# Altium project Inverter_540VDC.PrjPcb
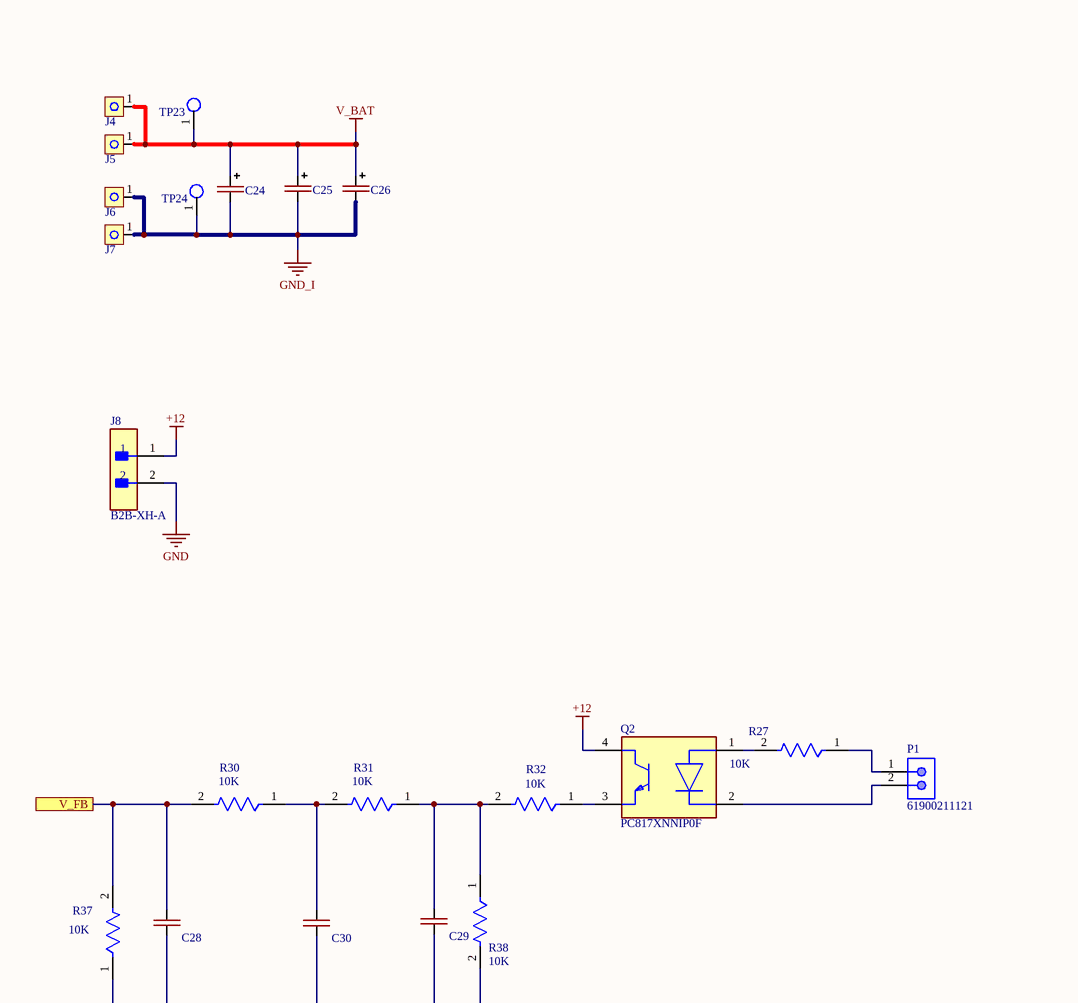
[diagram p0: Inverter_540VDC.SchDoc, top left]
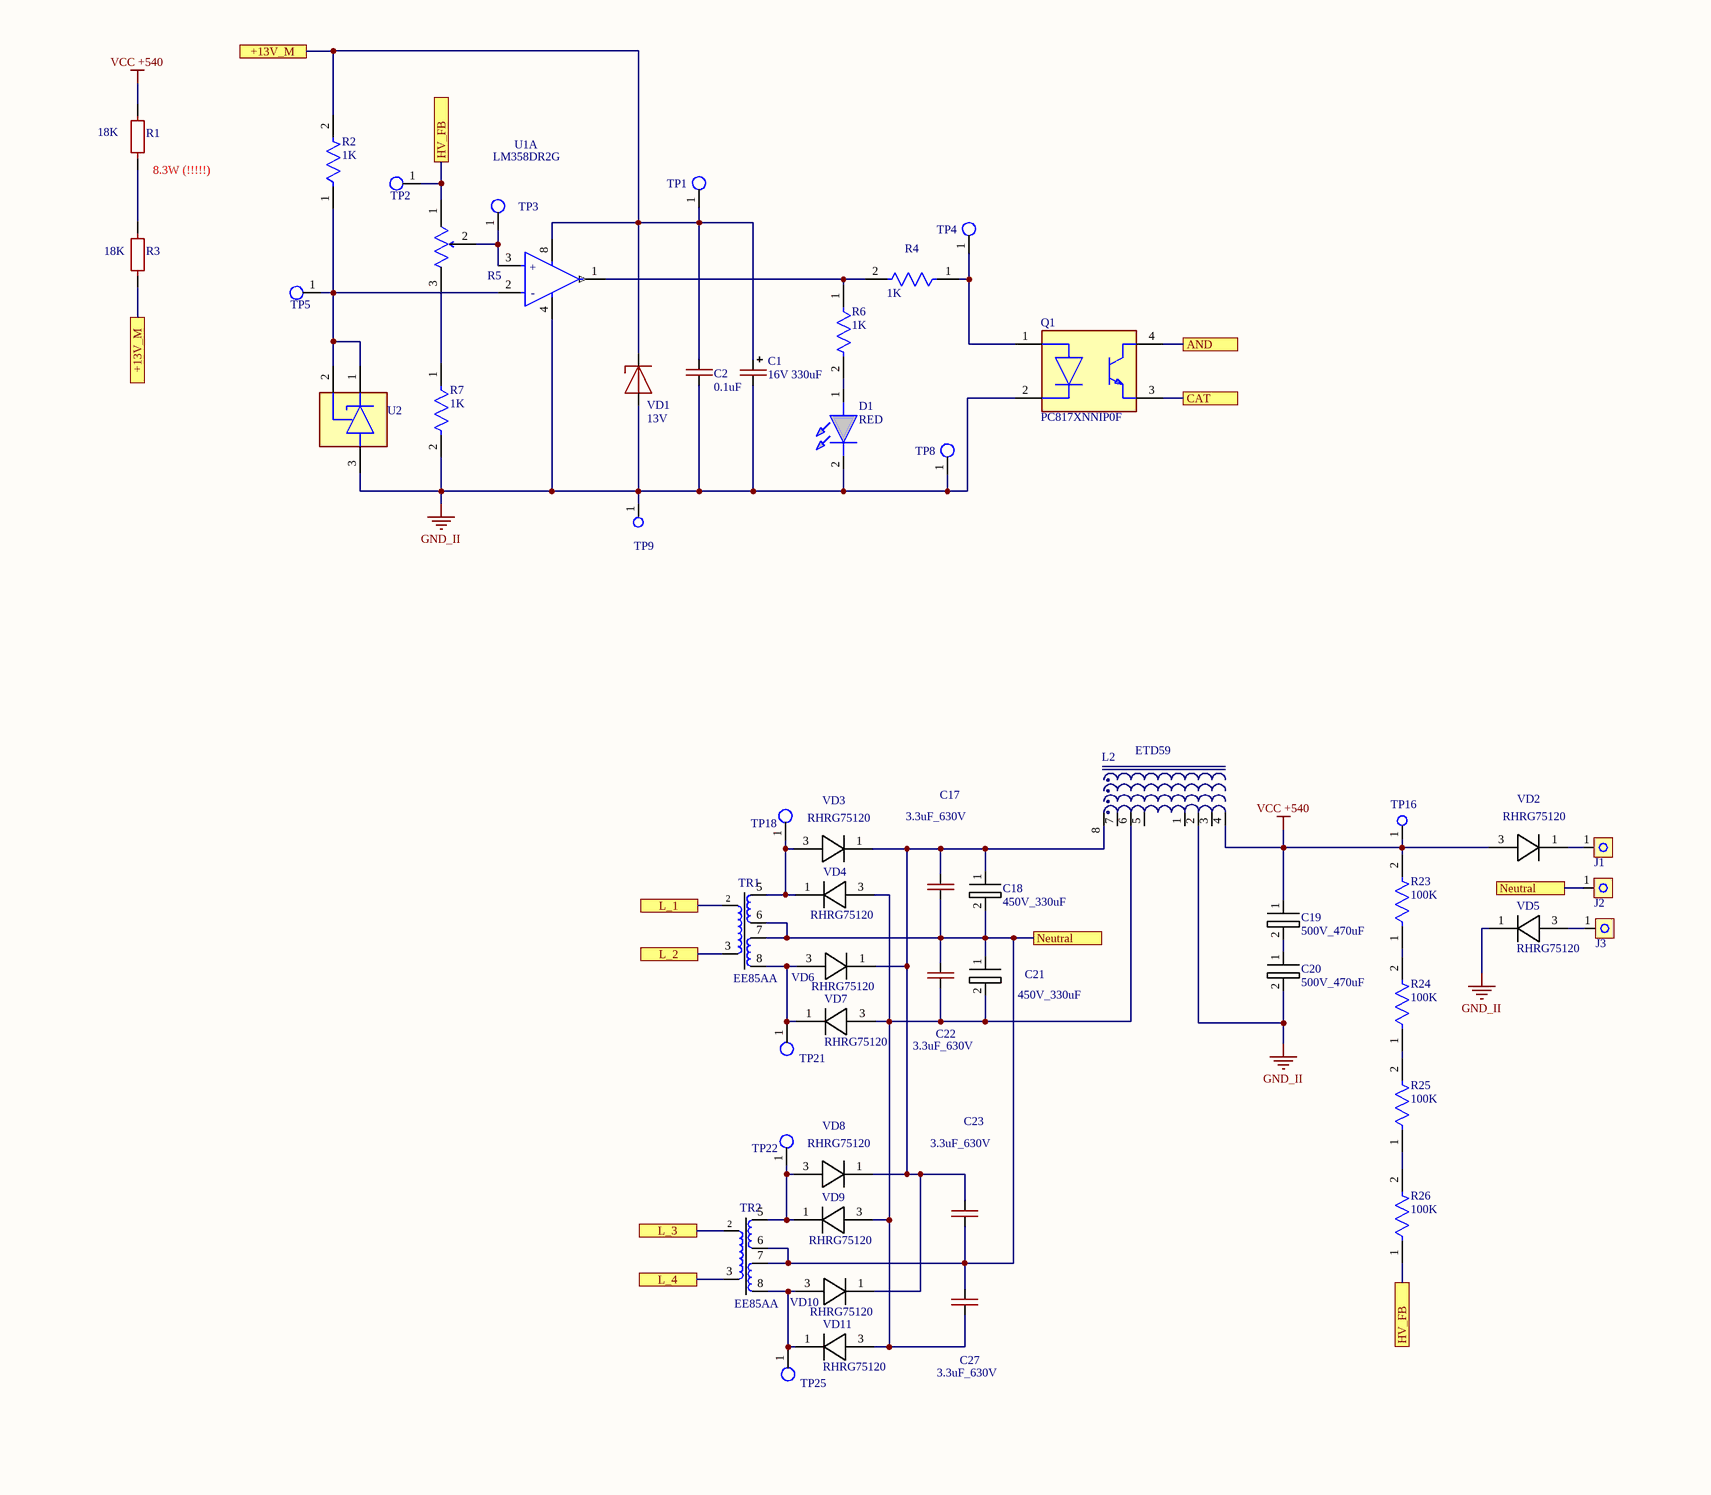
[diagram p1: Inverter_540VDC.SchDoc, top right]
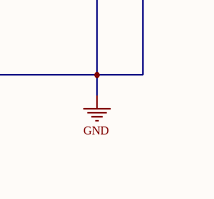
[diagram p2: Inverter_540VDC.SchDoc, bottom left]
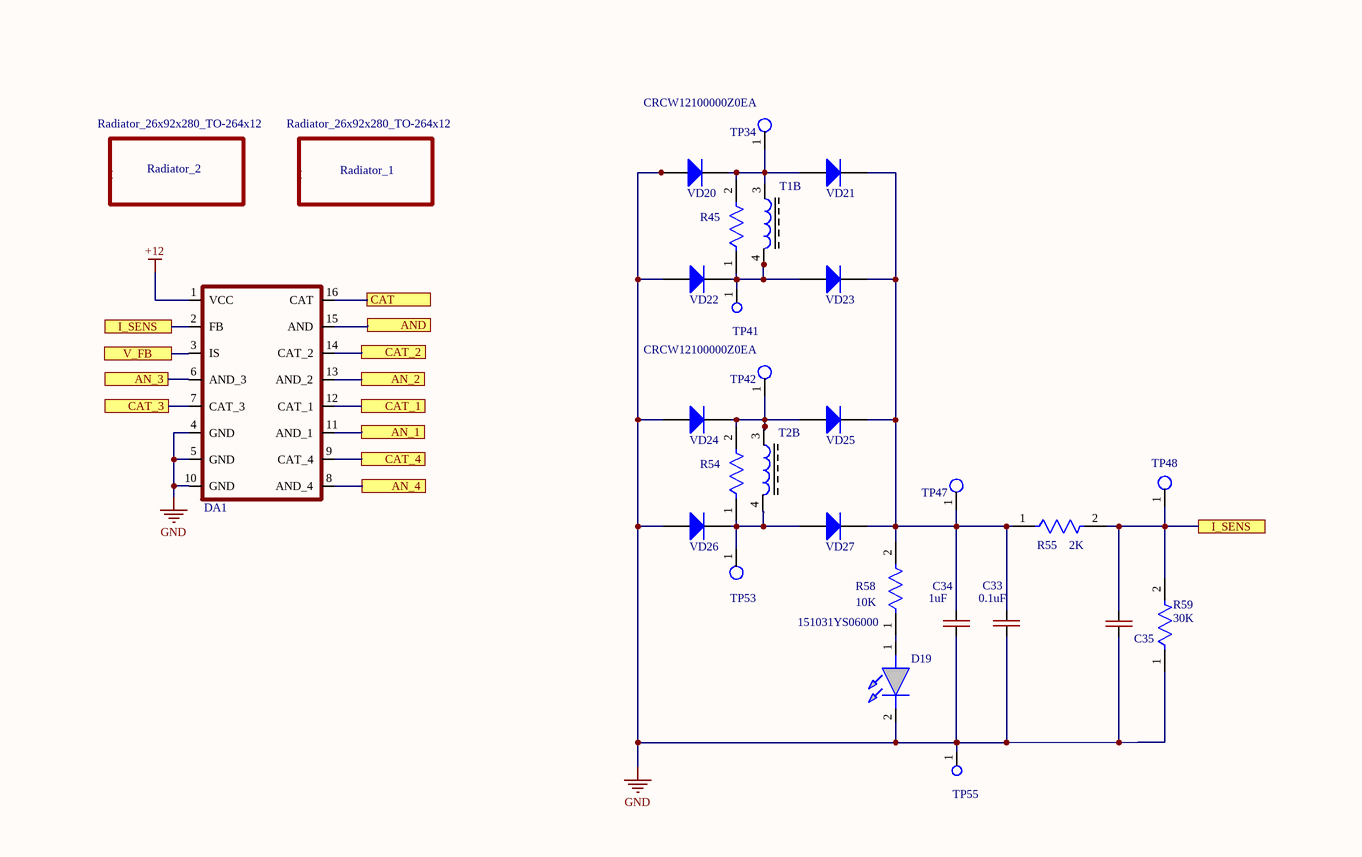
[diagram p3: Inverter_540VDC.SchDoc, bottom middle]
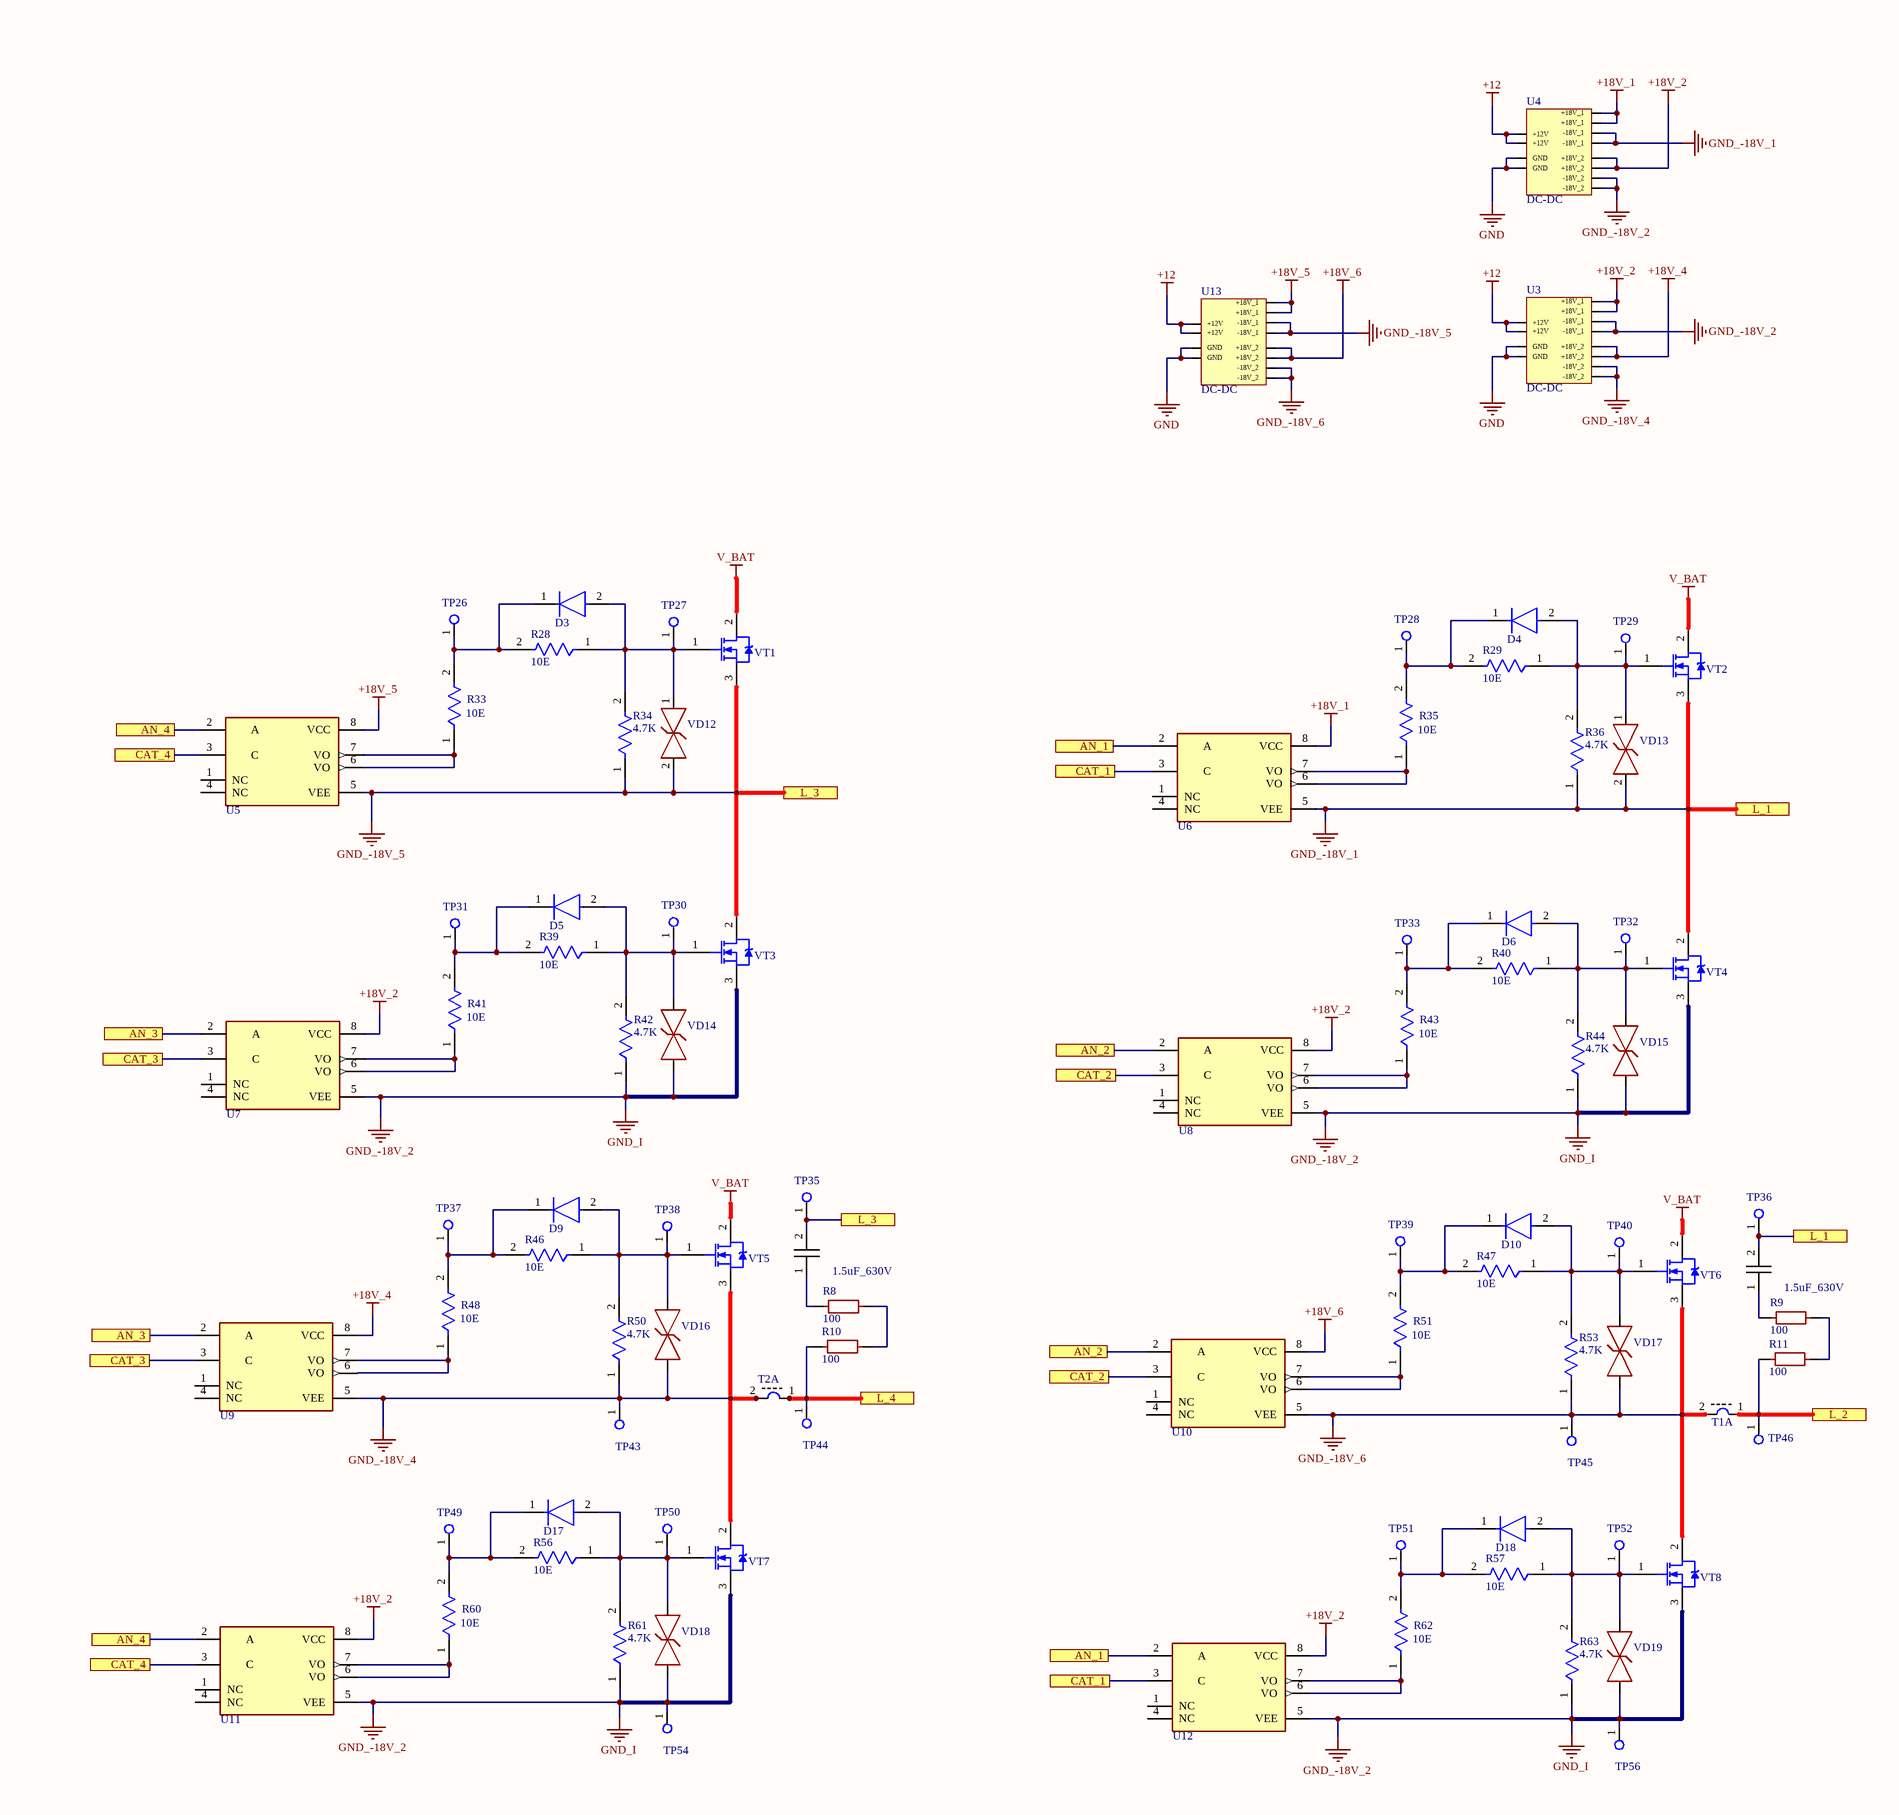
[diagram p4: Inverter_540VDC.SchDoc, bottom right]
1 sheet, 193 parts. Net scope: flat (ports and power ports of the same name join across sheets).
Board file: Inverter_540VDC.PcbDoc

## Sheet Inverter_540VDC.SchDoc
size 1200 x 800 mm; SheetNumber: 1; SheetTotal: 1; SPICEModelCacheFSXMRDBX: <root> / <DocumentId>FSXMRDBX</DocumentId> / </root>

### Parts
(Parts that share a designator on the sheet are numbered #1, #2 ... from top to bottom, then left to right.)
?#1  1.5uF_630V  [CAP_1.5uf_400V]
?#2  1.5uF_630V  [CAP_1.5uf_400V]
C1  16V 330uF  [CAP_SMD_Size_E]
C2  0.1uF  [CAP-0805]
C17  3.3uF_630V  [CAP_4.7uF_630V]
C18  450V_330uF  [CAP_450V_330uF]
C19  500V_470uF  [CAP_450V_330uF]
C20  500V_470uF  [CAP_450V_330uF]
C21  450V_330uF  [CAP_450V_330uF]
C22  3.3uF_630V  [CAP_4.7uF_630V]
C23  3.3uF_630V  [CAP_4.7uF_630V]
C24  1000uF_50V  [CAP_100V_1500uF]  (value not drawn)
C25  1000uF_50V  [CAP_100V_1500uF]  (value not drawn)
C26  1000uF_50V  [CAP_100V_1500uF]  (value not drawn)
C27  3.3uF_630V  [CAP_4.7uF_630V]
C28  CAP-NON-POLAR  [CAP-0805]  (value not drawn)
C29  CAP-NON-POLAR  [CAP-0805]  (value not drawn)
C30  CAP-NON-POLAR  [CAP-0805]  (value not drawn)
C33  0.1uF  [CAP-0805]
C34  1uF  [CAP-0805]
C35  CAP-NON-POLAR  [CAP-0805]  (value not drawn)
D1  RED  [LED_RED]
D3  US1G  [DO-214AA]  (value not drawn)
D4  US1G  [DO-214AA]  (value not drawn)
D5  US1G  [DO-214AA]  (value not drawn)
D6  US1G  [DO-214AA]  (value not drawn)
D9  US1G  [DO-214AA]  (value not drawn)
D10  US1G  [DO-214AA]  (value not drawn)
D17  US1G  [DO-214AA]  (value not drawn)
D18  US1G  [DO-214AA]  (value not drawn)
D19  151031YS06000  [LED_GREEN]
DA1  PWM_Controller_Half_Bridge_ONLY_TL494  [PWM_Controller_Half_Bridge_ONLY_TL494]  (value not drawn)
J1  MG_136_HT  [Conn_MEIGAN_MG136HT]  (value not drawn)
J2  MG_136_HT  [Conn_MEIGAN_MG136HT]  (value not drawn)
J3  MG_136_HT  [Conn_MEIGAN_MG136HT]  (value not drawn)
J4  MG_136_HT  [Conn_MEIGAN_MG136HT]  (value not drawn)
J5  MG_136_HT  [Conn_MEIGAN_MG136HT]  (value not drawn)
J6  MG_136_HT  [Conn_MEIGAN_MG136HT]  (value not drawn)
J7  MG_136_HT  [Conn_MEIGAN_MG136HT]  (value not drawn)
J8  B2B-XH-A  [B2B-XH-A]
L2  ETD59  [Drossel]
P1  61900211121  [61900211121]
Q1  PC817XNNIP0F  [FP-PC817XNNIP0F-MFG]
Q2  PC817XNNIP0F  [FP-PC817XNNIP0F-MFG]
R1  18K  [RES_5W_VERT]
R2  1K  [RES-0805]
R3  18K  [RES_5W_VERT]
R4  1K  [RES-0805]
R5  10K  [RES_Adj_3296W_Bourns]  (value not drawn)
R6  1K  [RES-0805]
R7  1K  [RES-0805]
R8  100  [RES_5W_VERT]
R9  100  [RES_5W_VERT]
R10  100  [RES_5W_VERT]
R11  100  [RES_5W_VERT]
R23  100K  [RES-0805]
R24  100K  [RES-0805]
R25  100K  [RES-0805]
R26  100K  [RES-0805]
R27  10K  [RES-0805]
R28  10E  [RES_SMD_1210_IPC_A]
R29  10E  [RES_SMD_1210_IPC_A]
R30  10K  [RES-0805]
R31  10K  [RES-0805]
R32  10K  [RES-0805]
R33  10E  [RES_SMD_1210_IPC_A]
R34  4.7K  [RES-0805]
R35  10E  [RES_SMD_1210_IPC_A]
R36  4.7K  [RES-0805]
R37  10K  [RES-0805]
R38  10K  [RES-0805]
R39  10E  [RES_SMD_1210_IPC_A]
R40  10E  [RES_SMD_1210_IPC_A]
R41  10E  [RES_SMD_1210_IPC_A]
R42  4.7K  [RES-0805]
R43  10E  [RES_SMD_1210_IPC_A]
R44  4.7K  [RES-0805]
R45  CRCW12100000Z0EA  [FP-CRCW1210-e3-IPC_B]
R46  10E  [RES_SMD_1210_IPC_A]
R47  10E  [RES_SMD_1210_IPC_A]
R48  10E  [RES_SMD_1210_IPC_A]
R50  4.7K  [RES-0805]
R51  10E  [RES_SMD_1210_IPC_A]
R53  4.7K  [RES-0805]
R54  CRCW12100000Z0EA  [FP-CRCW1210-e3-IPC_B]
R55  2K  [RES-0805]
R56  10E  [RES_SMD_1210_IPC_A]
R57  10E  [RES_SMD_1210_IPC_A]
R58  10K  [RES-0805]
R59  30K  [RES-0805]
R60  10E  [RES_SMD_1210_IPC_A]
R61  4.7K  [RES-0805]
R62  10E  [RES_SMD_1210_IPC_A]
R63  4.7K  [RES-0805]
Radiator_1  Radiator_26х92х280_ТО-264х12  [Radiator_26х92х280_ТО-264х12]  (value not drawn)
Radiator_2  Radiator_26х92х280_ТО-264х12  [Radiator_26х92х280_ТО-264х12]  (value not drawn)
T1  Current_SENS_VERT  [Current_SENS_VERT]  (value not drawn)  (parts A,B of 2)
T2  Current_SENS_VERT  [Current_SENS_VERT]  (value not drawn)  (parts A,B of 2)
TP1  Test_Point_PCB  [Test_Point]  (value not drawn)
TP2  Test_Point_PCB  [Test_Point]  (value not drawn)
TP3  Test_Point_PCB  [Test_Point]  (value not drawn)
TP4  Test_Point_PCB  [Test_Point]  (value not drawn)
TP5  Test_Point_PCB  [Test_Point]  (value not drawn)
TP8  Test_Point_PCB  [Test_Point]  (value not drawn)
TP9  Test_Point_PCB  [Pin_Test_Point(Pink)]  (value not drawn)
TP16  Test_Point_PCB  [Test_Point]  (value not drawn)
TP18  Test_Point_PCB  [Test_Point]  (value not drawn)
TP21  Test_Point_PCB  [Test_Point]  (value not drawn)
TP22  Test_Point_PCB  [Test_Point]  (value not drawn)
TP23  (no value)  [Test_Point]
TP24  Test_Point_PCB  [Test_Point]  (value not drawn)
TP25  Test_Point_PCB  [Test_Point]  (value not drawn)
TP26  Test_Point_PCB  [Test_Point]  (value not drawn)
TP27  Test_Point_PCB  [Test_Point]  (value not drawn)
TP28  Test_Point_PCB  [Test_Point]  (value not drawn)
TP29  Test_Point_PCB  [Test_Point]  (value not drawn)
TP30  Test_Point_PCB  [Test_Point]  (value not drawn)
TP31  Test_Point_PCB  [Test_Point]  (value not drawn)
TP32  Test_Point_PCB  [Test_Point]  (value not drawn)
TP33  Test_Point_PCB  [Test_Point]  (value not drawn)
TP34  Test_Point_PCB  [Test_Point]  (value not drawn)
TP35  Test_Point_PCB  [Test_Point]  (value not drawn)
TP36  Test_Point_PCB  [Test_Point]  (value not drawn)
TP37  Test_Point_PCB  [Test_Point]  (value not drawn)
TP38  Test_Point_PCB  [Test_Point]  (value not drawn)
TP39  Test_Point_PCB  [Test_Point]  (value not drawn)
TP40  Test_Point_PCB  [Test_Point]  (value not drawn)
TP41  Test_Point_PCB  [Test_Point]  (value not drawn)
TP42  Test_Point_PCB  [Test_Point]  (value not drawn)
TP43  Test_Point_PCB  [Pin_Test_Point(Orange)]  (value not drawn)
TP44  Test_Point_PCB  [Test_Point]  (value not drawn)
TP45  Test_Point_PCB  [Pin_Test_Point(Orange)]  (value not drawn)
TP46  Test_Point_PCB  [Test_Point]  (value not drawn)
TP47  Test_Point_PCB  [Test_Point]  (value not drawn)
TP48  (no value)  [Test_Point]
TP49  Test_Point_PCB  [Test_Point]  (value not drawn)
TP50  Test_Point_PCB  [Test_Point]  (value not drawn)
TP51  Test_Point_PCB  [Test_Point]  (value not drawn)
TP52  Test_Point_PCB  [Test_Point]  (value not drawn)
TP53  Test_Point_PCB  [Test_Point]  (value not drawn)
TP54  Test_Point_PCB  [Pin_Test_Point(Orange)]  (value not drawn)
TP55  Test_Point_PCB  [Pin_Test_Point(Orange)]  (value not drawn)
TP56  Test_Point_PCB  [Pin_Test_Point(Orange)]  (value not drawn)
TR1  EE85AA  [EE84AA Hor]
TR2  EE85AA  [EE84AA Hor]
U1  LM358DR2G  [FP-751-07-IPC_C]  (part A of 2)
U2  (no value)  [TL431_SOT-23-3(A)]
U3  DC-DC  [DC-DC_Bridge]
U4  DC-DC  [DC-DC_Bridge]
U5  HCPL-3120  [HCPL-3120]  (value not drawn)
U6  HCPL-3120  [HCPL-3120]  (value not drawn)
U7  HCPL-3120  [HCPL-3120]  (value not drawn)
U8  HCPL-3120  [HCPL-3120]  (value not drawn)
U9  HCPL-3120  [HCPL-3120]  (value not drawn)
U10  HCPL-3120  [HCPL-3120]  (value not drawn)
U11  HCPL-3120  [HCPL-3120]  (value not drawn)
U12  HCPL-3120  [HCPL-3120]  (value not drawn)
U13  DC-DC  [DC-DC_Bridge]
VD1  13V  [DO-017AA]
VD2  RHRG75120  [TO-247-2]
VD3  RHRG75120  [TO-247-2]
VD4  RHRG75120  [TO-247-2]
VD5  RHRG75120  [TO-247-2]
VD6  RHRG75120  [TO-247-2]
VD7  RHRG75120  [TO-247-2]
VD8  RHRG75120  [TO-247-2]
VD9  RHRG75120  [TO-247-2]
VD10  RHRG75120  [TO-247-2]
VD11  RHRG75120  [TO-247-2]
VD12  Suppressor  [DO-214AA]  (value not drawn)
VD13  Suppressor  [DO-214AA]  (value not drawn)
VD14  Suppressor  [DO-214AA]  (value not drawn)
VD15  Suppressor  [DO-214AA]  (value not drawn)
VD16  Suppressor  [DO-214AA]  (value not drawn)
VD17  Suppressor  [DO-214AA]  (value not drawn)
VD18  Suppressor  [DO-214AA]  (value not drawn)
VD19  Suppressor  [DO-214AA]  (value not drawn)
VD20  (no value)  [DIOD-SOD123-2_V]
VD21  (no value)  [DIOD-SOD123-2_V]
VD22  (no value)  [DIOD-SOD123-2_V]
VD23  (no value)  [DIOD-SOD123-2_V]
VD24  (no value)  [DIOD-SOD123-2_V]
VD25  (no value)  [DIOD-SOD123-2_V]
VD26  (no value)  [DIOD-SOD123-2_V]
VD27  (no value)  [DIOD-SOD123-2_V]
VT1  SPW47N60  [TO-247-3(Infineon)]  (value not drawn)
VT2  SPW47N60  [TO-247-3(Infineon)]  (value not drawn)
VT3  SPW47N60  [TO-247-3(Infineon)]  (value not drawn)
VT4  SPW47N60  [TO-247-3(Infineon)]  (value not drawn)
VT5  SPW47N60  [TO-247-3(Infineon)]  (value not drawn)
VT6  SPW47N60  [TO-247-3(Infineon)]  (value not drawn)
VT7  SPW47N60  [TO-247-3(Infineon)]  (value not drawn)
VT8  SPW47N60  [TO-247-3(Infineon)]  (value not drawn)

### Ports
+13V_M, AN_1, AN_2, AN_3, AN_4, AND, CAT, CAT_1, CAT_2, CAT_3, CAT_4, HV_FB, I_SENS, L_1, L_2, L_3, L_4, Neutral, V_FB

### Nets
+12: DA1.1(VCC) J8.1 Q2.4(C) U3.8(+12V) U3.9(+12V) U4.8(+12V) U4.9(+12V) U13.8(+12V) U13.9(+12V)
+18V_1: U4.1(+18V_1) U4.2(+18V_1) U6.8(VCC)
+18V_2: U3.1(+18V_1) U3.2(+18V_1) U4.17(+18V_2) U4.18(+18V_2) U7.8(VCC) U8.8(VCC) U11.8(VCC) U12.8(VCC)
+18V_4: U3.17(+18V_2) U3.18(+18V_2) U9.8(VCC)
+18V_5: U5.8(VCC) U13.1(+18V_1) U13.2(+18V_1)
+18V_6: U10.8(VCC) U13.17(+18V_2) U13.18(+18V_2)
GND: C28.1 C29.1 C30.1 C33.2 C34.2 C35.1 D19.2(K) DA1.4(GND) DA1.5(GND) DA1.10(GND) J8.2 R37.1 R38.2 R59.1 TP55.1(G9) U3.10(GND) U3.11(GND) U4.10(GND) U4.11(GND) U13.10(GND) U13.11(GND) VD20.2(A) VD22.2(A) VD24.2(A) VD26.2(A)
GND_-18V_1: ?#2.2 R36.1 TP36.1(G9) TR1.2 U4.3(-18V_1) U4.4(-18V_1) U6.5(VEE) VD13.2(A) VT2.3(SOURCE) VT4.2(DRAIN) ; port L_1
GND_-18V_2: C24.2(-) C25.2(-) C26.2(-) J6.1 J7.1 R42.1 R44.1 R61.1 R63.1 TP24.1(G9) TP54.1(G9) TP56.1(G9) U3.3(-18V_1) U3.4(-18V_1) U4.15(-18V_2) U4.16(-18V_2) U7.5(VEE) U8.5(VEE) U11.5(VEE) U12.5(VEE) VD14.1(C) VD15.1(C) VD18.1(C) VD19.1(C) VT3.3(SOURCE) VT4.3(SOURCE) VT7.3(SOURCE) VT8.3(SOURCE)  [also labelled GND_I]
GND_-18V_4: R50.1 T2.2 TP43.1(G9) U3.15(-18V_2) U3.16(-18V_2) U9.5(VEE) VD16.1(C) VT5.3(SOURCE) VT7.2(DRAIN)
GND_-18V_5: ?#1.2 R34.1 TP35.1(G9) TR2.2 U5.5(VEE) U13.3(-18V_1) U13.4(-18V_1) VD12.2(A) VT1.3(SOURCE) VT3.2(DRAIN) ; port L_3
GND_-18V_6: R53.1 T1.2 TP45.1(G9) U10.5(VEE) U13.15(-18V_2) U13.16(-18V_2) VD17.1(C) VT6.3(SOURCE) VT8.2(DRAIN)
GND_II: C1.2(-) C2.1 C20.2 D1.2(K) L2.2 Q1.2(C) R7.2 TP8.1(G9) TP9.1(G9) U1.4(VEE/GND) U2.3(A) VD1.2(A) VD5.1
V_BAT: C24.1(+) C25.1(+) C26.1(+) J4.1 J5.1 TP23.1(G9) VT1.2(DRAIN) VT2.2(DRAIN) VT5.2(DRAIN) VT6.2(DRAIN)
VCC +540: C19.1 L2.4 R1.2 R23.2 TP16.1(G9) VD2.3
Net?#1_1: ?#1.1 R8.2
Net?#2_1: ?#2.1 R9.2
NetC1_1: C1.1(+) C2.2 R2.2 R3.1 TP1.1(G9) U1.8(VCC) VD1.1(C) ; port +13V_M
NetC17_1: C17.1 C18.2 C21.1 C22.2 C23.1 C27.2 J2.1 TR1.6 TR1.7 TR2.6 TR2.7 ; port Neutral
NetC17_2: C17.2 C18.1 C23.2 L2.8 VD3.1 VD6.1 VD8.1 VD10.1
NetC19_2: C19.2 C20.1
NetC21_2: C21.2 C22.1 C27.1 L2.6 VD4.3 VD7.3 VD9.3 VD11.3
NetC28_2: C28.2 DA1.3(IS) R30.2 R37.2 ; port V_FB
NetC29_2: C29.2 R31.1 R32.2 R38.1
NetC30_2: C30.2 R30.1 R31.2
NetC33_1: C33.1 C34.1 R55.1 R58.2 TP47.1(G9) VD21.1(K) VD23.1(K) VD25.1(K) VD27.1(K)
NetC35_2: C35.2 DA1.2(FB) R55.2 R59.2 TP48.1(G9) ; port I_SENS
NetD1_1: D1.1(A) R6.2
NetD3_1: D3.1(C) R28.2 R33.2 TP26.1(G9)
NetD3_2: D3.2(A) R28.1 R34.2 TP27.1(G9) VD12.1(C) VT1.1(GATE)
NetD4_1: D4.1(C) R29.2 R35.2 TP28.1(G9)
NetD4_2: D4.2(A) R29.1 R36.2 TP29.1(G9) VD13.1(C) VT2.1(GATE)
NetD5_1: D5.1(C) R39.2 R41.2 TP31.1(G9)
NetD5_2: D5.2(A) R39.1 R42.2 TP30.1(G9) VD14.2(A) VT3.1(GATE)
NetD6_1: D6.1(C) R40.2 R43.2 TP33.1(G9)
NetD6_2: D6.2(A) R40.1 R44.2 TP32.1(G9) VD15.2(A) VT4.1(GATE)
NetD9_1: D9.1(C) R46.2 R48.2 TP37.1(G9)
NetD9_2: D9.2(A) R46.1 R50.2 TP38.1(G9) VD16.2(A) VT5.1(GATE)
NetD10_1: D10.1(C) R47.2 R51.2 TP39.1(G9)
NetD10_2: D10.2(A) R47.1 R53.2 TP40.1(G9) VD17.2(A) VT6.1(GATE)
NetD17_1: D17.1(C) R56.2 R60.2 TP49.1(G9)
NetD17_2: D17.2(A) R56.1 R61.2 TP50.1(G9) VD18.2(A) VT7.1(GATE)
NetD18_1: D18.1(C) R57.2 R62.2 TP51.1(G9)
NetD18_2: D18.2(A) R57.1 R63.2 TP52.1(G9) VD19.2(A) VT8.1(GATE)
NetD19_1: D19.1(A) R58.1
NetDA1_6: DA1.6(AND_3) U7.2(A) U9.2(A) ; port AN_3
NetDA1_7: DA1.7(CAT_3) U7.3(C) U9.3(C) ; port CAT_3
NetDA1_8: DA1.8(AND_4) U5.2(A) U11.2(A) ; port AN_4
NetDA1_9: DA1.9(CAT_4) U5.3(C) U11.3(C) ; port CAT_4
NetDA1_11: DA1.11(AND_1) U6.2(A) U12.2(A) ; port AN_1
NetDA1_12: DA1.12(CAT_1) U6.3(C) U12.3(C) ; port CAT_1
NetDA1_13: DA1.13(AND_2) U8.2(A) U10.2(A) ; port AN_2
NetDA1_14: DA1.14(CAT_2) U8.3(C) U10.3(C) ; port CAT_2
NetDA1_15: DA1.15(AND) Q1.4(C) ; port AND
NetDA1_16: DA1.16(CAT) Q1.3(E) ; port CAT
NetJ1_1: J1.1 VD2.1
NetJ3_1: J3.1 VD5.3
NetP1_1: P1.1 R27.1
NetP1_2: P1.2 Q2.2(C)
NetQ1_1: Q1.1(A) R4.1 TP4.1(G9)
NetQ2_1: Q2.1(A) R27.2
NetQ2_3: Q2.3(E) R32.1
NetR1_1: R1.1 R3.2
NetR2_1: R2.1 TP5.1(G9) U1.2(INPUT_A-) U2.1(C) U2.2(REF)
NetR4_2: R4.2 R6.1 U1.1(OUTPUT_A)
NetR5_1: R5.1(CCW) R26.1 TP2.1(G9) ; port HV_FB
NetR5_2: R5.2(WIPER) TP3.1(G9) U1.3(INPUT_A+)
NetR5_3: R5.3(CW) R7.1
NetR8_1: R8.1 R10.1
NetR9_1: R9.1 R11.1
NetR10_2: R10.2 T2.1 TP44.1(G9) TR2.3 ; port L_4
NetR11_2: R11.2 T1.1 TP46.1(G9) TR1.3 ; port L_2
NetR23_1: R23.1 R24.2
NetR24_1: R24.1 R25.2
NetR25_1: R25.1 R26.2
NetR33_1: R33.1 U5.6(VO) U5.7(VO)
NetR35_1: R35.1 U6.6(VO) U6.7(VO)
NetR41_1: R41.1 U7.6(VO) U7.7(VO)
NetR43_1: R43.1 U8.6(VO) U8.7(VO)
NetR45_1: R45.1 T1.4 TP41.1(G9) VD22.1(K) VD23.2(A)
NetR45_2: R45.2 T1.3 TP34.1(G9) VD20.1(K) VD21.2(A)
NetR48_1: R48.1 U9.6(VO) U9.7(VO)
NetR51_1: R51.1 U10.6(VO) U10.7(VO)
NetR54_1: R54.1 T2.4 TP53.1(G9) VD26.1(K) VD27.2(A)
NetR54_2: R54.2 T2.3 TP42.1(G9) VD24.1(K) VD25.2(A)
NetR60_1: R60.1 U11.6(VO) U11.7(VO)
NetR62_1: R62.1 U12.6(VO) U12.7(VO)
NetTP18_1: TP18.1(G9) TR1.5 VD3.3 VD4.1
NetTP21_1: TP21.1(G9) TR1.8 VD6.3 VD7.1
NetTP22_1: TP22.1(G9) TR2.5 VD8.3 VD9.1
NetTP25_1: TP25.1(G9) TR2.8 VD10.3 VD11.1

Not connected (* = marked no-connect by the designer): L2 1 3 5 7; U5 1(NC) 4(NC); U6 1(NC) 4(NC); U7 1(NC) 4(NC); U8 1(NC) 4(NC); U9 1(NC) 4(NC); U10 1(NC) 4(NC); U11 1(NC) 4(NC); U12 1(NC) 4(NC)

### Notes on the sheet
- (near R1) 8.3W (!!!!!)
- (in symbol CMP-1310-00291-2, part A) +; -

### Library data of the parts
?#1 ?#2 = 3.3uF_630V
C1 = CAP_POL_SMD
C2 C17 C22 C23 C27 C33 C34 = CAP-NON-POLAR
C18-C21 = CAP_450V_330uF
C24-C26 = CAP_polar_Hitano
D1 D19 = LED: WURTH ELEKTRONIK - 151031YS06000 - LED, Yellow, Through Hole, T-1 (3mm), 30 mA, 2 V, 590 nm; Geometry.Height: 5.5mm; Manufacturer_Name: Wurth Elektronik; Manufacturer_Part_Number: 151031YS06000; Mouser Part Number: 710-151031YS06000; Mouser Price/Stock: https://www.mouser.co.uk/ProductDetail/Wurth-Elektronik/151031YS06000?qs=LlUlMxKIyB3xSYYW%252BcuBiQ%3D%3D; Arrow Part Number: *; Arrow Price/Stock: *; Mouser Testing Part Number: *; Mouser Testing Price/Stock: *; Datasheet Link: https://katalog.we-online.de/led/datasheet/151031YS06000.pdf
J1-J7 = Connector_MEIGAN_MG136HT
L2 = DROSSEL: Drosel; PartNumber: 750311457; Manufacturer: Wuerth Elektronik; Ui: 36V; ComponentLink1Description: Manufacturer URL; ComponentLink2Description: Datasheet; ComponentLink1URL: http://www.we-online.com; PackageReference: EP13; ComponentLink2URL: http://katalog.we-online.de/pbs/datasheet/750311457.pdf
P1 = 61900211121: WR-WTB THT Male Vertical Locking Header, pitch 2.54mm, 2p; Pin Number: 2; Contact Resistance: 20mOhm; Rated Current: 3A; Withstanding Voltage: 1000VAC; Working Voltage: 250VAC; ComponentLink1Description: Manufacturer; ComponentLink1URL: http://www.we-online.de; ComponentLink2Description: Datasheet; ComponentLink2URL: https://www.we-online.com/catalog/datasheet/61900211121.pdf; Pitch: 2.54mm; Published Date: January 2020; Publisher: Wurth Elektronik; Mounting Technology: THT; Packaging: Bag; Operating Temperature: -40 to +105degC; Part Number: 61900211121; Gender: Male; Type: Vertical
Q1 Q2 = CMP-65434-000005-1: OPTOISOLATOR 5KV TRANS 4SMD; Reverse Breakdown Voltage: 6V; Output Current per Channel: 30mA; Power Dissipation: 200mW; Collector-emitter Voltage-Max: 200mV; Max Output Voltage: 80V; Input Current: 50mA; Forward Voltage: 1.4V; Fall Time: 18000ns; Number of Elements: 1; Input Type: DC; Packaging: Tape and Reel; RoHS Compliant: Yes; Contact Plating: Copper; Min Operating Temperature: -30°C; Collector Emitter Saturation Voltage: 200mV; Max Input Current: 50mA; Radiation Hardening: No; Max Collector Current: 50mA; Case/Package: SMD/SMT; Mount: Surface Mount; Output Voltage: 80V; Forward Current: 50mA; Max Power Dissipation: 200mW; Collector Emitter Voltage (VCEO): 80V; Number of Channels: 1; Rise Time: 18000ns; Isolation Voltage: 5kV; Number of Pins: 4; Lead Free: Lead Free; Package Quantity: 2000; Isolation Voltage-Max: 5kV; Max Operating Temperature: 100°C
R1 R3 R7-R11 R23-R27 R30-R32 R34 R36-R38 R42 R44 R50 R53 R55 R58 R59 R61 R63 = RES-CONST
R2 = RES-CONST: 18K
R4 R6 = RES-CONST: 5K
R5 = RES_Adj
R28 R29 R33 R35 R39-R41 R43 R46-R48 R51 R56 R57 R60 R62 = RES_1210
R45 R54 = CMP-2005-01987-2: RES SMD 205K OHM 1% 1/2W 1992; Resistance: 0mR; Temperature Coefficient: 0ppm/°C; Max Power Dissipation: 500mW; Voltage Rating: 200V; Packaging: Tape and Reel; Max Operating Temperature: 155°C; REACH SVHC: No SVHC; Min Operating Temperature: -55°C; Package Quantity: 1; Length: 3.2mm; Case Code (Metric): 3225; Case/Package: 1210; Composition: Thick Film; Military Standard: Not; Contact Plating: Tin; Case Code (Imperial): 1210; Radiation Hardening: No; Depth: 2.5mm; Termination: SMD/SMT; Features: Automotive AEC-Q200; Width: 0.098inch; Mount: Surface Mount; Power Rating: 500mW; Weight: 0.000564oz; Number of Terminations: 2; Height: 0.55mm
TP1-TP5 TP8 TP9 TP16 TP18 TP21-TP56 = TP_PCB?: Test_Point
TR1 TR2 = TR-EE85AA
U1 = CMP-1310-00291-2: IC OPAMP GP 2 CIRCUIT 8SOIC; Gain Bandwidth Product: 1MHz; Number of Circuits: 2; Min Supply Voltage: 3V; Slew Rate: 0.6V/µs; Max Dual Supply Voltage: 16V; Common Mode Rejection Ratio: 65dB; Input Bias Current: 250nA; Min Dual Supply Voltage: 1.5V; Dual Supply Voltage: 9V; Operating Supply Current: 1.5mA; Output Current: 40mA; Input Offset Voltage (Vos): 7mV; Nominal Supply Current: 1.2mA; Voltage Gain: 100dB; Max Supply Voltage: 32V; Width: 4mm; Number of Pins: 8; Min Operating Temperature: 0°C; REACH SVHC: No SVHC; Contact Plating: Tin; Lead Free: Lead Free; Halogen Free: Halogen Free; Power Supply Rejection Ratio (PSRR): 65dB; Operating Supply Voltage: 16V; Package Quantity: 2500; Max Operating Temperature: 70°C; Case/Package: SOIC; Height: 1.5mm; Packaging: Tape and Reel; Radiation Hardening: No; Number of Channels: 2; Bandwidth: 1MHz; Length: 5mm; Number of Elements: 2; Number of Amplifiers: 2; Output Current per Channel: 40mA
U2 = TL431_SOT-23-3
U3 U4 U13 = DC-DC/12-18VDC
VD1 = ZENER
VD2-VD11 = MUR4060
VD20-VD27 = 1N4148: Fast Switching Diode, 100 V, 0.15 A, -65 to 150 degC, 2-Pin?SOD123, RoHS, Tape and Reel; Recovery Time: 4ns; Brand: DiodesIncorporated; Unit Weight: 0.000353oz; Max Surge Current: 2A; Peak Reverse Voltage: 100V; Ir - Reverse Current: 1uA; Vf - Forward Voltage: 1.25V; Configuration: Single; If - Forward Current: 0.15A; Product Category: Diodes-GeneralPurpose,Power,Switching; Operating Temperature Range: -65Cto+150C; Packaging: Reel; Manufacturer URL: http://www.diodes.com/; Maximum Operating Temperature: +150C; Height: 1.25mm; Minimum Operating Temperature: -65C; Product: SwitchingDiodes; Package URL: http://www.diodes.com/datasheets/ds18004.pdf; Type: SwitchingDiode; Package Reference: SOD123-2; Width: 1.7mm; Datasheet URL: http://www.farnell.com/datasheets/1915529.pdf; Datasheet Version: Rev. 24-2, 10/2013; Series: 1N4148; Factory Pack Quantity: 3000; Length: 2.85mm; RoHS: True; Manufacturer: DiodesIncorporated; Mounting Style: SMD/SMT; Package / Case: SOD-123